# EAGLE schematic schem (EAGLE 9.6.2)
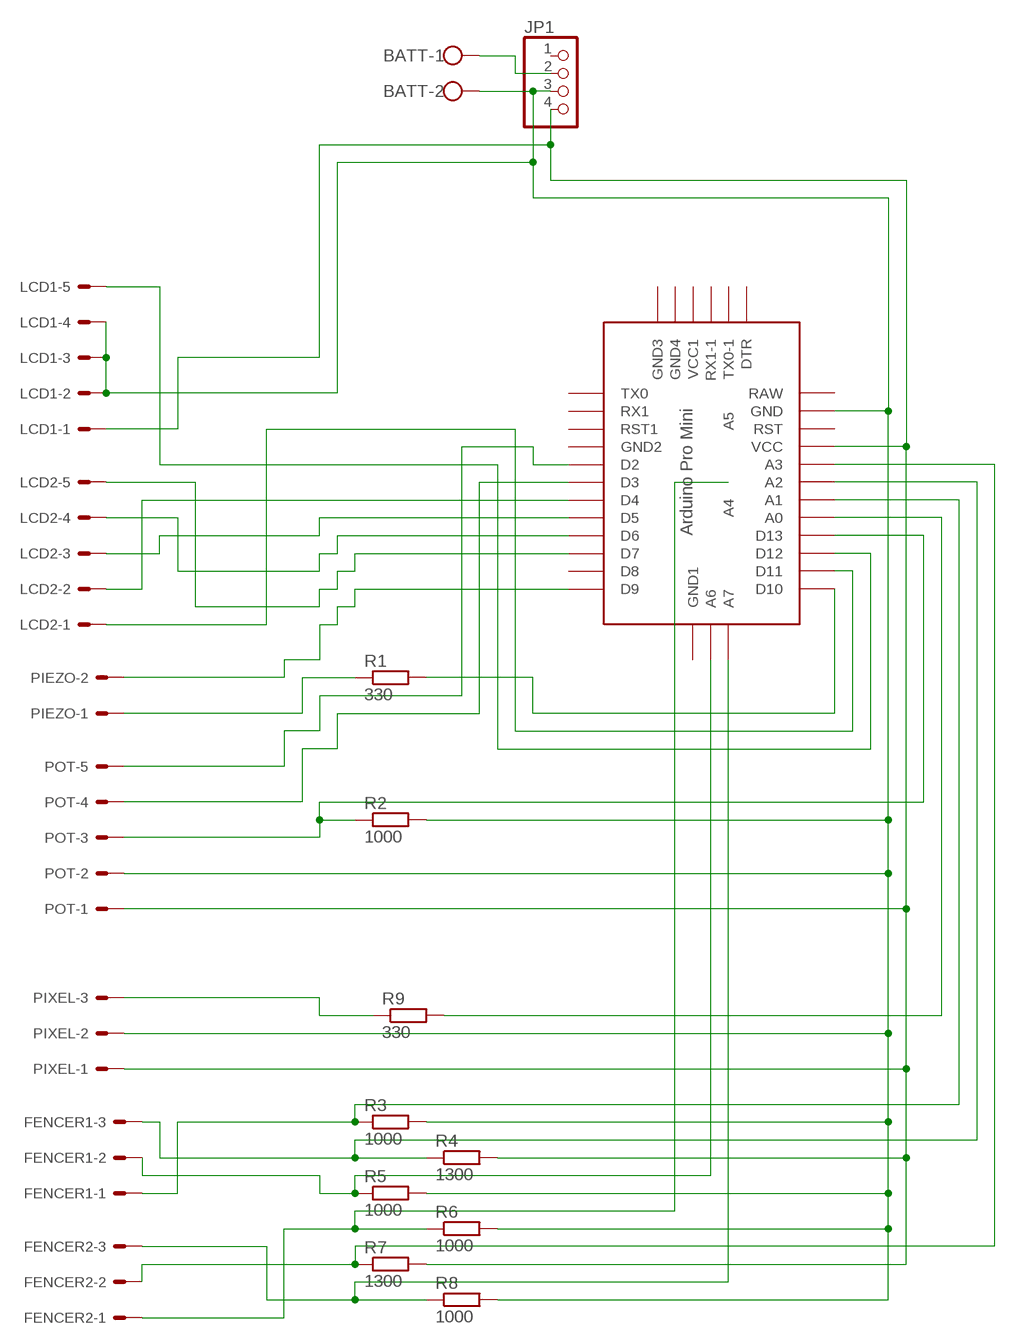
[diagram p0: schematic, sheet 1]

## Parts
BATT  W237-102  [W237-102]
FENCER1  22-27-2031-03  [6410-03]
FENCER2  22-27-2031-03  [6410-03]
JP1  PINHD-1X4  [1X04]
LCD1  22-27-2051-05  [6410-05]
LCD2  22-27-2051-05  [6410-05]
PIEZO  22-27-2021-02  [6410-02]
PIXEL  22-27-2031-03  [6410-03]
POT  22-27-2051-05  [6410-05]
R1  330  R-EU_0204/7  [0204/7]
R2  1000  R-EU_0204/7  [0204/7]
R3  1000  R-EU_0204/7  [0204/7]
R4  1300  R-EU_0204/7  [0204/7]
R5  1000  R-EU_0204/7  [0204/7]
R6  1000  R-EU_0204/7  [0204/7]
R7  1300  R-EU_0204/7  [0204/7]
R8  1000  R-EU_0204/7  [0204/7]
R9  330  R-EU_0207/10  [0207/10]
U$1  ABK-PRO-MINI  [ABK-PRO-MINI]

## Nets
N$1: JP1.4 LCD1.1 PIXEL.1 POT.1 R4.2 R7.2 U$1.VCC
N$2: BATT.2 JP1.3 LCD1.2 LCD1.3 LCD1.4 PIXEL.2 POT.2 R2.2 R3.2 R5.2 R6.2 R8.2 U$1.GND
N$3: BATT.1 JP1.2
N$4: LCD2.4 U$1.D6
N$5: LCD2.1 U$1.D11
N$6: LCD1.5 U$1.D12
N$7: LCD2.2 U$1.D4
N$8: LCD2.3 U$1.D5
N$9: LCD2.5 U$1.D7
N$10: PIEZO.2 U$1.D9
N$11: PIEZO.1 R1.1
N$12: R1.2 U$1.D10
N$13: POT.5 U$1.D2
N$14: POT.4 U$1.D3
N$15: FENCER1.1 R3.1 U$1.A1
N$16: POT.3 R2.1 U$1.D13
N$17: R9.2 U$1.A0
N$18: FENCER1.3 R4.1 U$1.A2
N$19: FENCER1.2 R5.1 U$1.A6
N$20: FENCER2.1 R6.1 U$1.A4
N$22: FENCER2.3 R8.1 U$1.A7
N$23: PIXEL.3 R9.1
N$24: FENCER2.2 R7.1 U$1.A3
Unconnected: JP1.1 U$1.A5 U$1.D8 U$1.DTR U$1.GND1(GND2) U$1.GND2(GND3) U$1.GND3(GND4) U$1.GND4(GND1) U$1.RAW U$1.RST U$1.RST1 U$1.RX1 U$1.RX1-1 U$1.TX0 U$1.TX0-1 U$1.VCC1

## Library data of the parts
BATT = con-wago-500:W237-102: WAGO SCREW CLAMP; MPN: 237-102; OC_FARNELL: unknown; OC_NEWARK: 70K9898
FENCER1 FENCER2 PIXEL = EP_molex_6410_7395:22-?-03: CONNECTOR wire to board 2.54 mm (.1 inch) pitch header
JP1 = pinhead:PINHD-1X4: PIN HEADER
LCD1 LCD2 POT = EP_molex_6410_7395:22-?-05: CONNECTOR wire to board 2.54 mm (.1 inch) pitch header
PIEZO = EP_molex_6410_7395:22-?-02: CONNECTOR wire to board 2.54 mm (.1 inch) pitch header
R1-R9 = rcl:R-EU_: RESISTOR, European symbol; SPICEPREFIX: R
U$1 = Arduino-clone:ABK-PRO-MINI: ABK Pro-Mini Arduino Clone